# Altium schematic sheet Connectors.SchDoc
size A4; SheetNumber: 6; SheetTotal: 9
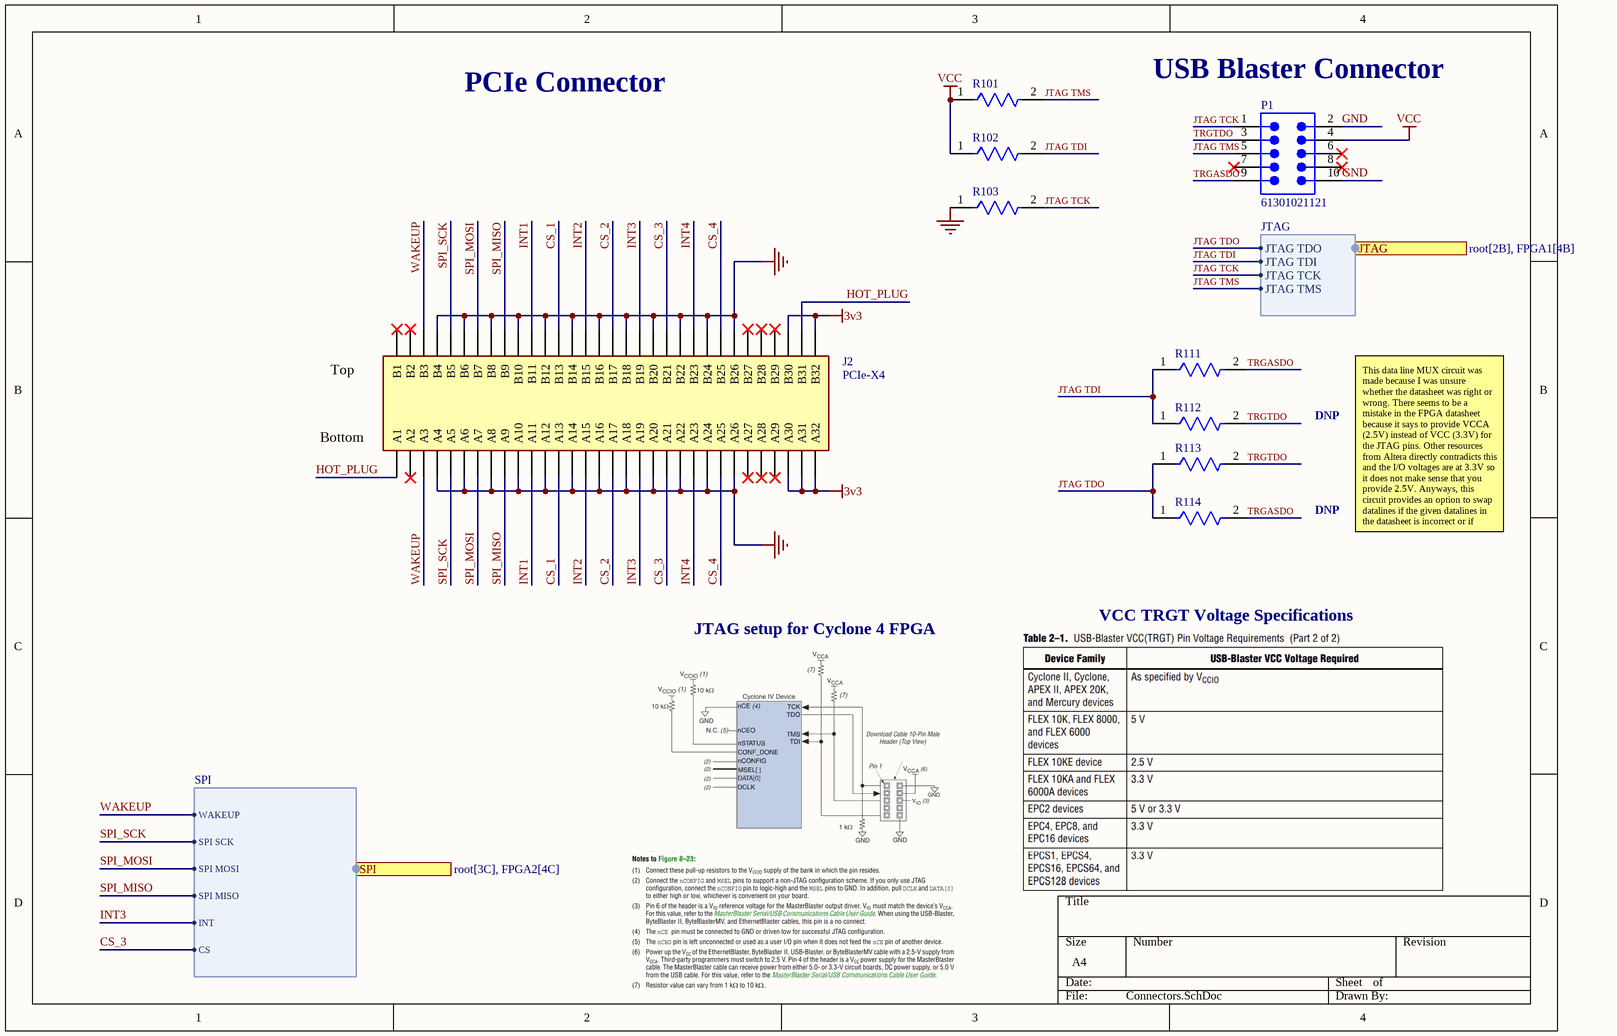
[diagram p0: Connectors.SchDoc]

## Parts
J2  PCIe-X4  [BUS_PCIexpress_x4]  (no BOM)
P1  61301021121  [61301021121]
R101  RC0402FR-071KL  [FP-RC0402-0_4-IPC_A]  (value not drawn)
R102  RC0402FR-071KL  [FP-RC0402-0_4-IPC_A]  (value not drawn)
R103  RC0402FR-071KL  [FP-RC0402-0_4-IPC_A]  (value not drawn)
R111  CRCW12060000ZSTA  [FP-CRCW1206-MFG]  (value not drawn)
R112  CRCW12060000ZSTA  [FP-CRCW1206-MFG]  (value not drawn)
R113  CRCW12060000ZSTA  [FP-CRCW1206-MFG]  (value not drawn)
R114  CRCW12060000ZSTA  [FP-CRCW1206-MFG]  (value not drawn)

## Ports
JTAG (harness JTAG, see root[2B], FPGA1[4B]), SPI (harness SPI, see root[3C], FPGA2[4C])

## Harnesses
JTAG: JTAG TDO, JTAG TDI, JTAG TCK, JTAG TMS
SPI: WAKEUP, SPI SCK, SPI MOSI, SPI MISO, INT, CS

## Nets
3v3: J2.A30 J2.A31 J2.A32 J2.B30 J2.B32
GND: J2.A4 J2.A6 J2.A8 J2.A10 J2.A12 J2.A14 J2.A16 J2.A18 J2.A20 J2.A22 J2.A24 J2.A26 J2.B4 J2.B6 J2.B8 J2.B10 J2.B12 J2.B14 J2.B16 J2.B18 J2.B20 J2.B22 J2.B24 J2.B26 P1.2 P1.10 R103.1
VCC: P1.4 R101.1 R102.1
CS_1: J2.A13 J2.B13
CS_2: J2.A17 J2.B17
CS_3: J2.A21 J2.B21 ; port SPI.CS
CS_4: J2.A25 J2.B25
HOT_PLUG: J2.A1 J2.B31
INT1: J2.A11 J2.B11
INT2: J2.A15 J2.B15
INT3: J2.A19 J2.B19 ; port SPI.INT
INT4: J2.A23 J2.B23
JTAG TCK: P1.1 R103.2 ; port JTAG.JTAG TCK
JTAG TDI: R102.2 R111.1 R112.1 ; port JTAG.JTAG TDI
JTAG TDO: R113.1 R114.1 ; port JTAG.JTAG TDO
JTAG TMS: P1.5 R101.2 ; port JTAG.JTAG TMS
SPI_MISO: J2.A9 J2.B9 ; port SPI.SPI MISO
SPI_MOSI: J2.A7 J2.B7 ; port SPI.SPI MOSI
SPI_SCK: J2.A5 J2.B5 ; port SPI.SPI SCK
TRGASDO: P1.9 R111.2 R114.2
TRGTDO: P1.3 R112.2 R113.2
WAKEUP: J2.A3 J2.B3 ; port SPI.WAKEUP

Not connected (* = marked no-connect by the designer): J2 A2* A27* A28* A29* B1* B2* B27* B28* B29*; P1 6* 7* 8*

## Notes on the sheet
- PCIe Connector
- (near P1) USB Blaster Connector
- (near J2) Top
- (near J2) Bottom
- DNP
- This data line MUX circuit was made because I was unsure whether the datasheet was right or wrong. There seems to be a mistake in the FPGA datasheet because it says to provide VCCA (2.5V) instead of VCC (3.3V) for the JTAG pins. Other resources from Altera directly contradicts this and the I/O voltages are at 3.3V so it does not make sense that you provide 2.5V. Anyways, this circuit provides an option to swap datalines if the given datalines in the datasheet is incorrect or if mistakes were made.
- JTAG setup for Cyclone 4 FPGA
- VCC TRGT Voltage Specifications

## Library data of the parts
P1 = CMP-1502-01084-4: THT Vertical Pin Header WR-PHD, Pitch 2.54 mm, Dual Row, 10 pins; Insulation Resistance: 1GΩ; Connector Type: Male Pin; Number of Contacts: 10; Pitch: 2.54mm; Contact Resistance: 20mΩ; Current Rating: 3A; Gender: Male; Insulation: Insulated; Voltage Rating: 250V; Mount: Through Hole; Orientation: Vertical; Max Operating Temperature: 105°C; Height: 8.89mm; Number of Pins: 10; Housing Material: PBT; Number of Positions: 10; Packaging: Bulk; RoHS: Compliant; Contact Mating Length: 5.9944mm; Lead Pitch: 2.54mm; Contact Gender: Male; Flammability Rating: UL94 V-0; Color: Black; Termination: Through Hole; Width: 12.7mm; Number of Rows: 2; Contact Material: Gold; Contact Plating: Gold; Operating Supply Voltage: 250V; Length: 12.7mm; Min Operating Temperature: -40°C; Row Spacing: 2.54mm
R101-R103 = CMP-2002-07472-3: RES 1K OHM 1% 1/16W 0402; Max Power Dissipation: 63mW; Resistance: 1kR; Voltage Rating (DC): 50V; Temperature Coefficient: 100ppm/°C; Power Rating: 62.5mW; Technology: THICK FILM; Size Code: 0402; Series: RC; Length: 1mm; Case/Package: 0402; Features: Moisture Resistant; Termination: SMD/SMT; Case Code (Metric): 1005; Reach SVHC Compliant: Yes; Number of Terminations: 2; Tolerance: 1%; Lead Free: Lead Free; Military Standard: Not; Resistor Type: Thick Film; Max Operating Temperature: 155°C; RoHS Compliant: Yes; Construction: Rectangular; Voltage Rating: 50V; Packaging: Tape and Reel; Height: 0.32mm; Number of Pins: 2; Resistance Tolerance: 1%; Case Code (Imperial): 0402; Depth: 0.5mm; Min Operating Temperature: -55°C; Width: 0.5mm
R111-R114 = CMP-00030-39388935-1: CRCW12060000ZSTA Zero Ohm Resistor, Jumper, 1206 [3216 Metric], Thick Film, 250 mW, Surface Mount; Voltage Rating (DC): 200V; Max Power Dissipation: 250mW; Temperature Coefficient: 100ppm/°C; Resistance: 0Ω; Packaging: Cut Tape; Lead Free: Contains Lead; Height: 609.6µm; Military Standard: Not; Min Operating Temperature: -55°C; Weight: 10.007382mg; Depth: 1.6mm; Termination: SMD/SMT; Mount: Surface Mount; RoHS: Compliant; Case Code (Metric): 3216; Max Operating Temperature: 155°C; NexarPartId: 39388935; Length: 3.2mm; Features: Automotive AEC-Q200; Case Code (Imperial): 1206; Composition: Thick Film; Case/Package: 1206; Voltage Rating: 200V; Width: 1.6mm; Contact Plating: Lead, Tin; Number of Terminations: 2; REACH SVHC: Unknown; Power Rating: 250mW; Radiation Hardening: No